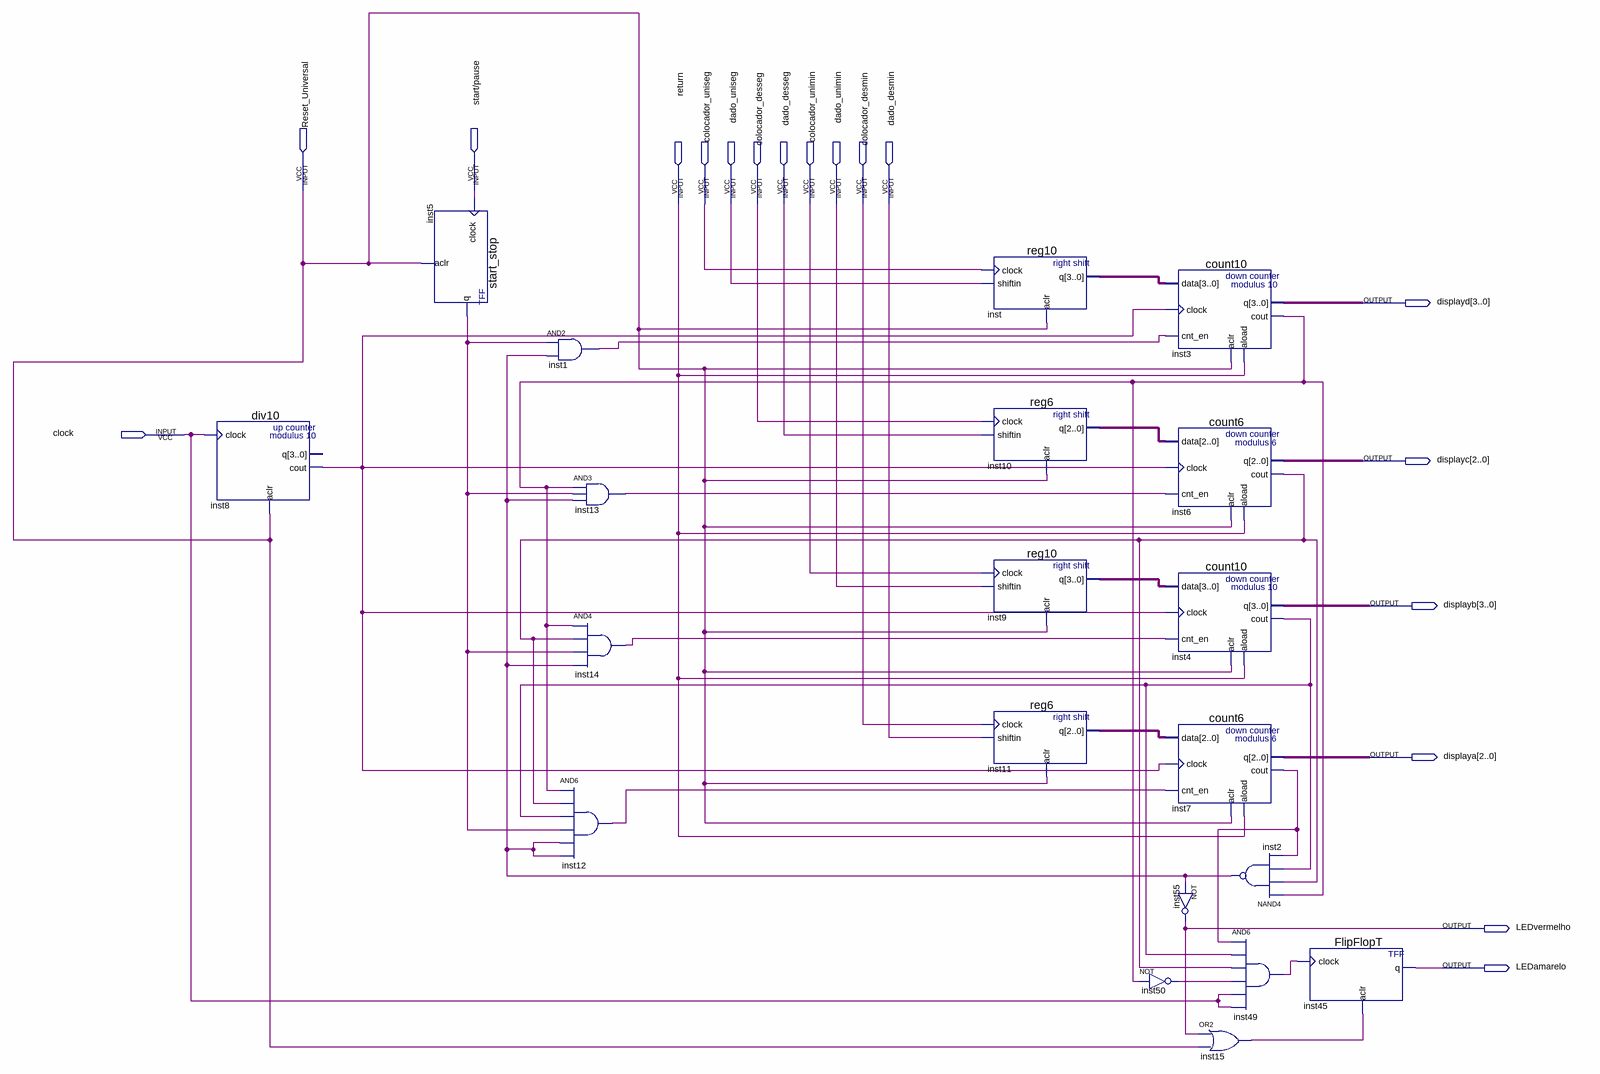
[diagram p0: schematic sheet]
// Quartus schematic Contador_Regressivo.bdf as structural Verilog: 20 symbols, 18 pins
module Contador_Regressivo (
  input  Reset_Universal,
  input  \start/pause ,
  input  \return ,
  input  colocador_uniseg,
  input  dado_uniseg,
  input  colocador_desseg,
  input  dado_desseg,
  input  colocador_unimin,
  input  dado_unimin,
  input  colocador_desmin,
  input  dado_desmin,
  input  clock,
  output [3:0] displayd,
  output [2:0] displayc,
  output [3:0] displayb,
  output [2:0] displaya,
  output LEDvermelho,
  output LEDamarelo
);

  wire inst1_out, inst2_out, inst3_cout, inst4_cout, inst5_q, inst6_cout, inst7_cout, inst8_cout, inst12_out,
       inst13_out, inst14_out, inst15_out, inst49_out, inst50_out;
  wire [2:0] inst10_q, inst11_q;
  wire [3:0] inst9_q, inst_q;

  div10 inst8 (.clock(clock), .aclr(Reset_Universal), .cout(inst8_cout));  // open: q
  start_stop inst5 (.clock(\start/pause ), .aclr(Reset_Universal), .q(inst5_q));
  and inst1 (inst1_out, inst5_q, inst2_out);
  and inst13 (inst13_out, inst3_cout, inst5_q, inst2_out);
  and inst14 (inst14_out, inst3_cout, inst6_cout, inst5_q, inst2_out);
  and inst12 (inst12_out, inst3_cout, inst6_cout, inst4_cout, inst5_q, inst2_out, inst2_out);
  reg10 inst (.clock(colocador_uniseg), .shiftin(dado_uniseg), .aclr(Reset_Universal), .q(inst_q));
  reg6 inst10 (.clock(colocador_desseg), .shiftin(dado_desseg), .aclr(Reset_Universal), .q(inst10_q));
  reg10 inst9 (.clock(colocador_unimin), .shiftin(dado_unimin), .aclr(Reset_Universal), .q(inst9_q));
  reg6 inst11 (.clock(colocador_desmin), .shiftin(dado_desmin), .aclr(Reset_Universal), .q(inst11_q));
  count10 inst3 (
    .data(inst_q), .clock(inst8_cout), .cnt_en(inst1_out), .aclr(Reset_Universal), .aload(\return ),
    .q(displayd), .cout(inst3_cout));
  count6 inst6 (
    .data(inst10_q), .clock(inst8_cout), .cnt_en(inst13_out), .aclr(Reset_Universal), .aload(\return ),
    .q(displayc), .cout(inst6_cout));
  count10 inst4 (
    .data(inst9_q), .clock(inst8_cout), .cnt_en(inst14_out), .aclr(Reset_Universal), .aload(\return ),
    .q(displayb), .cout(inst4_cout));
  count6 inst7 (
    .data(inst11_q), .clock(inst8_cout), .cnt_en(inst12_out), .aclr(Reset_Universal), .aload(\return ),
    .q(displaya), .cout(inst7_cout));
  not inst55 (LEDvermelho, inst2_out);
  not inst50 (inst50_out, inst3_cout);
  nand inst2 (inst2_out, inst3_cout, inst6_cout, inst4_cout, inst7_cout);
  and inst49 (inst49_out, inst7_cout, inst4_cout, inst6_cout, inst50_out, clock, clock);
  or inst15 (inst15_out, LEDvermelho, Reset_Universal);
  FlipFlopT inst45 (.clock(inst49_out), .aclr(inst15_out), .q(LEDamarelo));
endmodule
